# Altium schematic sheet 01.SchDoc
size 840 x 594 mm; Разраб.: Гришель; Обозначение документа: ГУИР.421457.001 Э3; Пров.: Станкевич; Т.контр.: Станкевич; Н.контр.: Лихачёв; Утв.: Петровский; Номер листа: 1; Общее количество листов: 2; Литера: Т; Наименование организации: БГУИР, гр. 250701; Наименование изделия 1: Плата отладочная; Наименование изделия 2: Схема электрическая; Наименование изделия 3: принципиальная; Нач. отд.: Реценз.
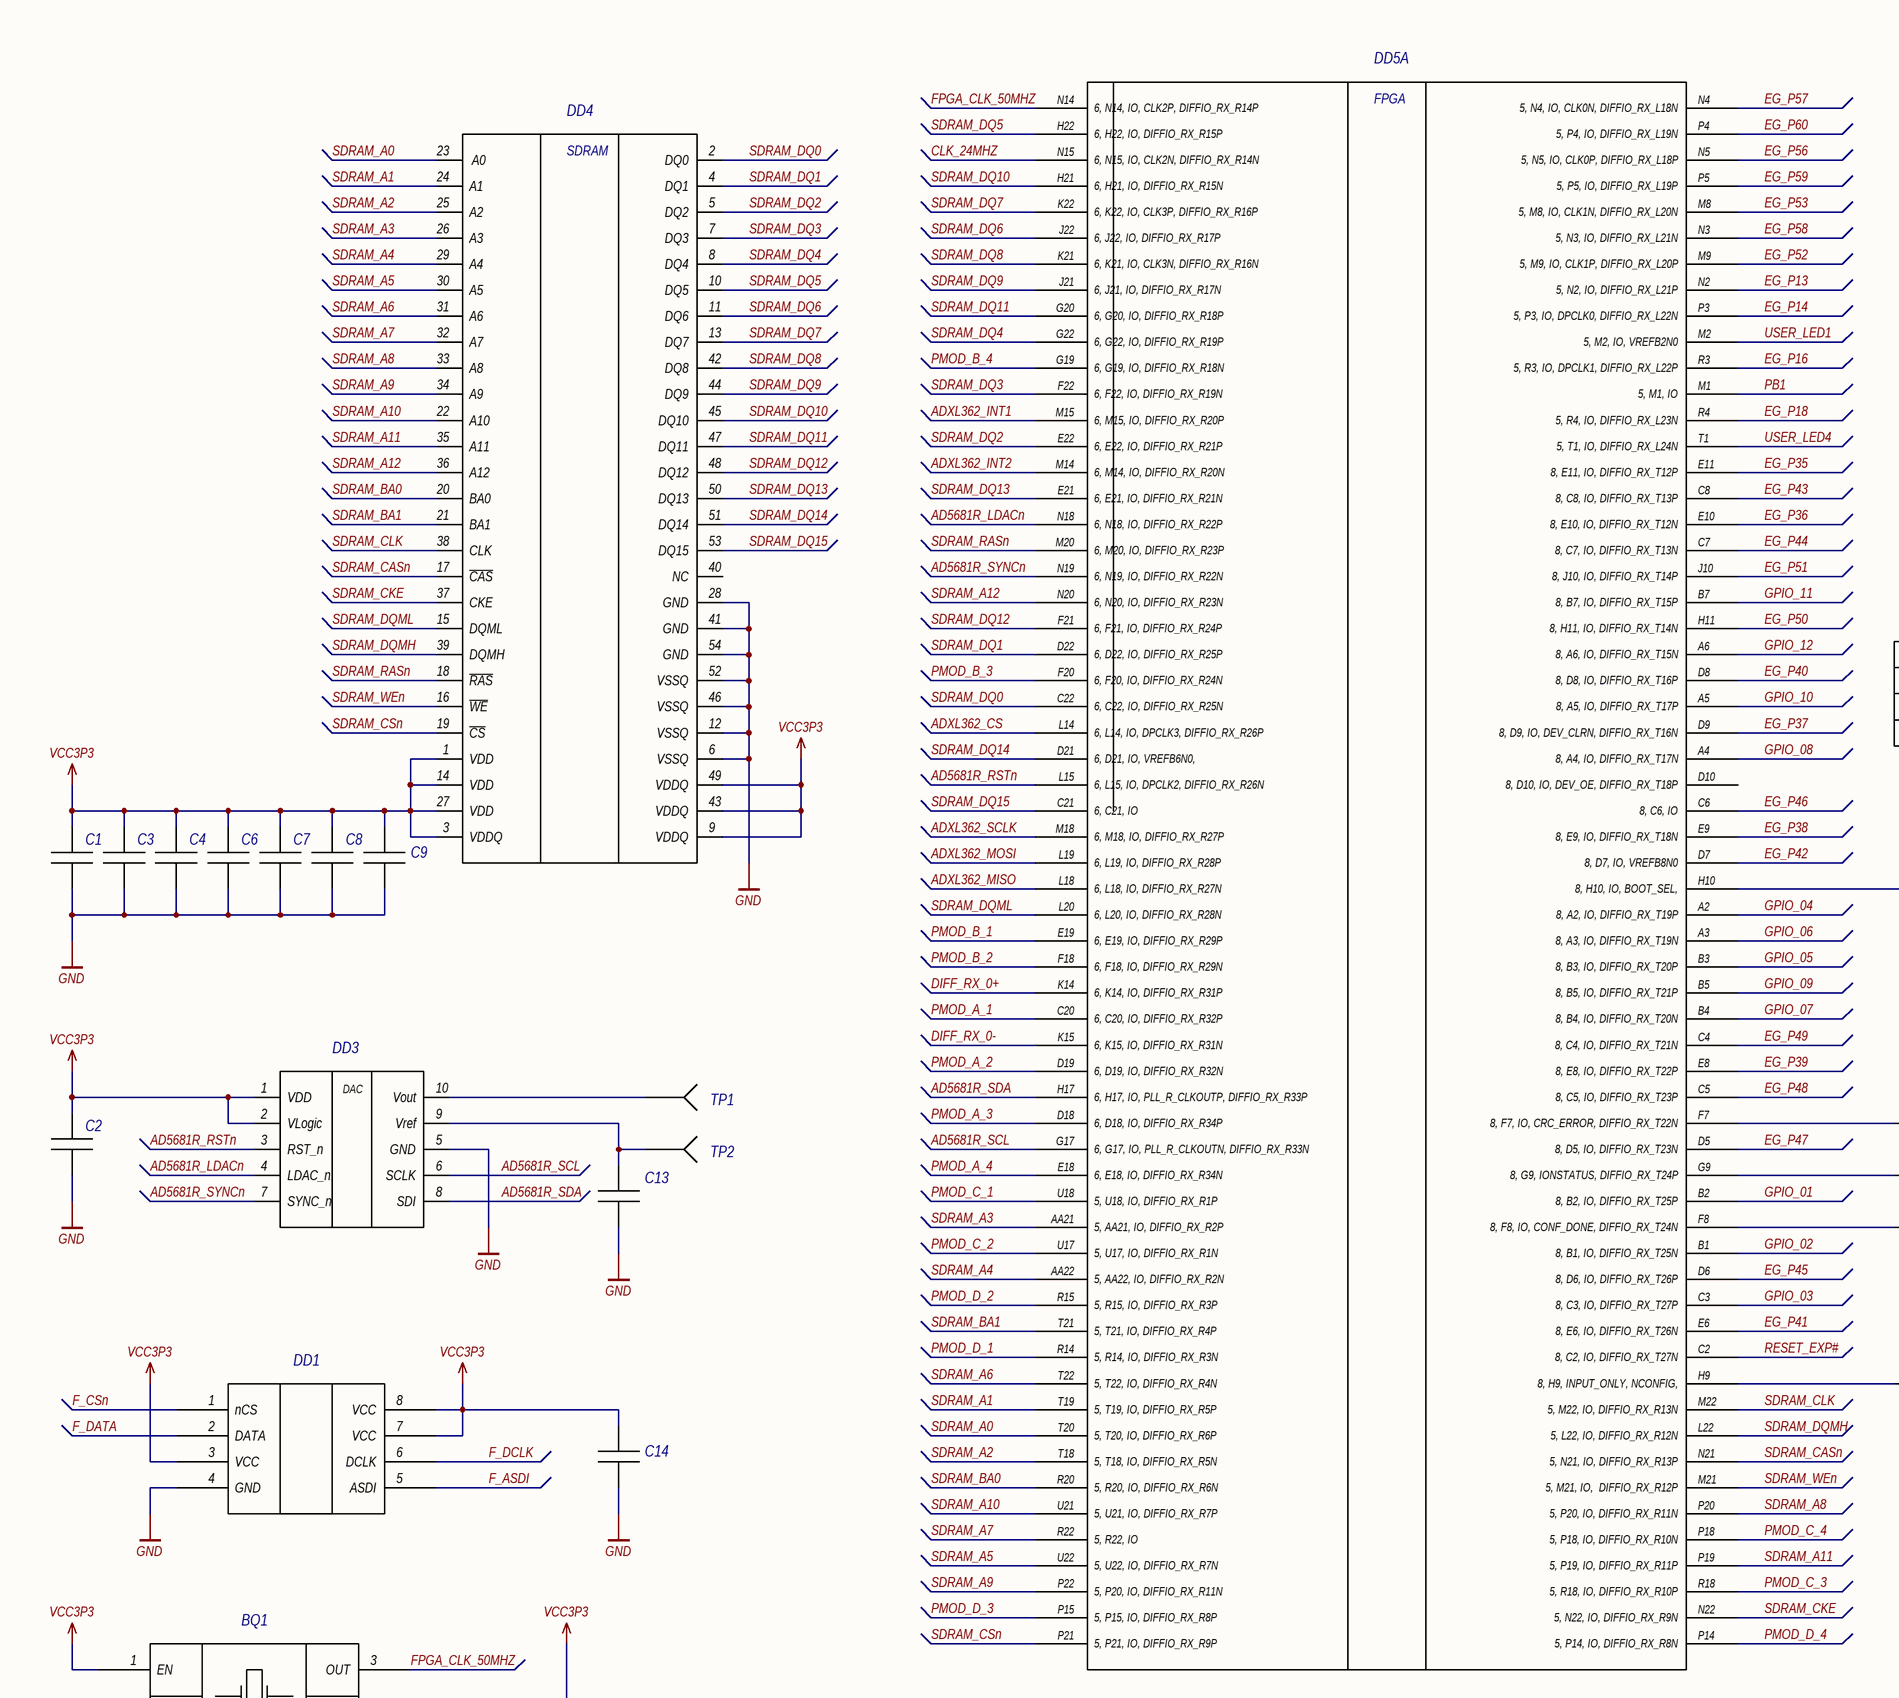
[diagram p0: 01.SchDoc, top left]
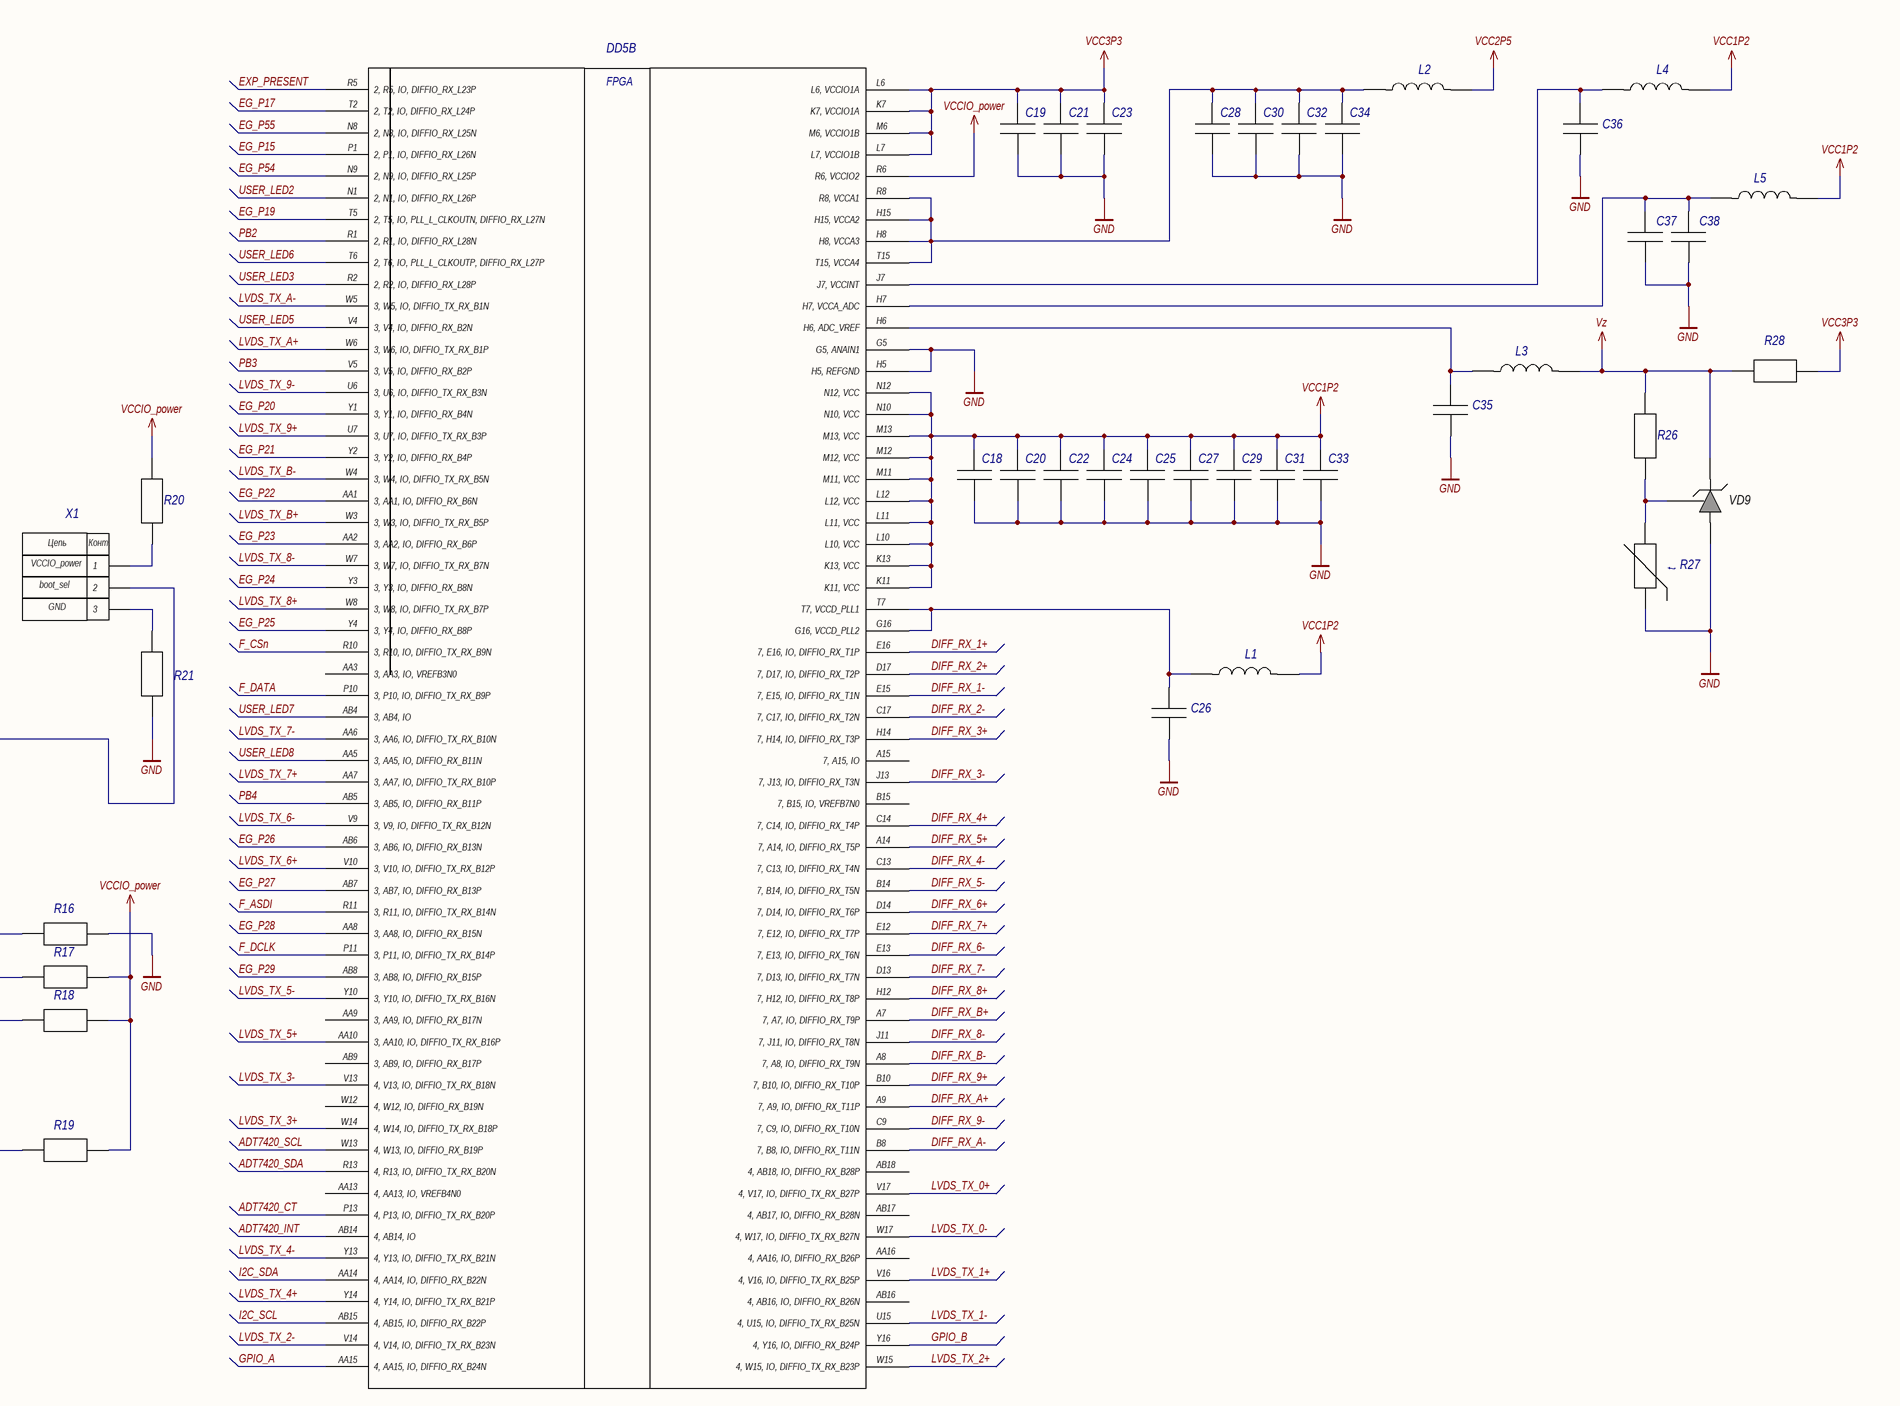
[diagram p1: 01.SchDoc, top right]
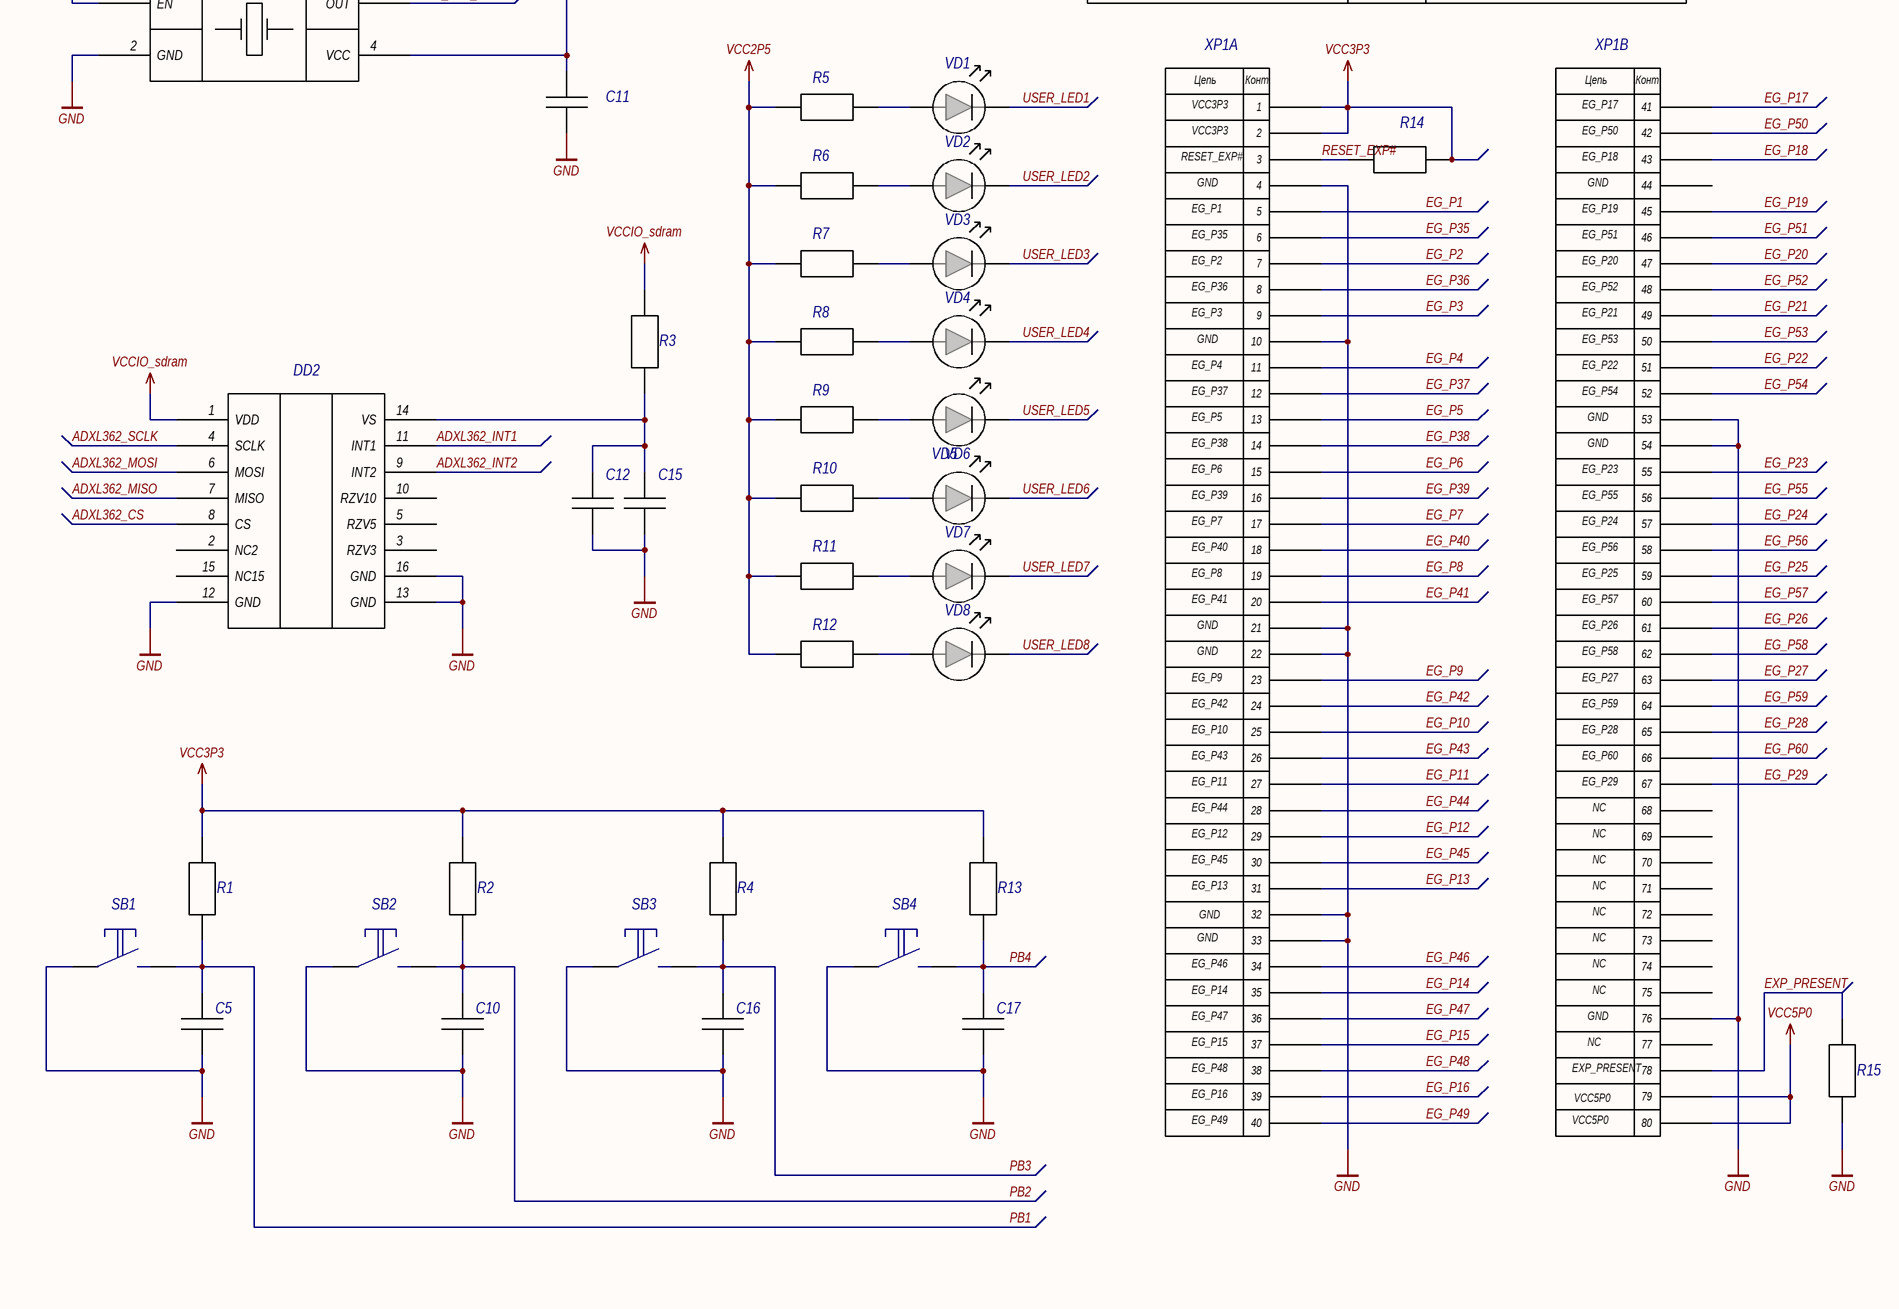
[diagram p2: 01.SchDoc, bottom left]
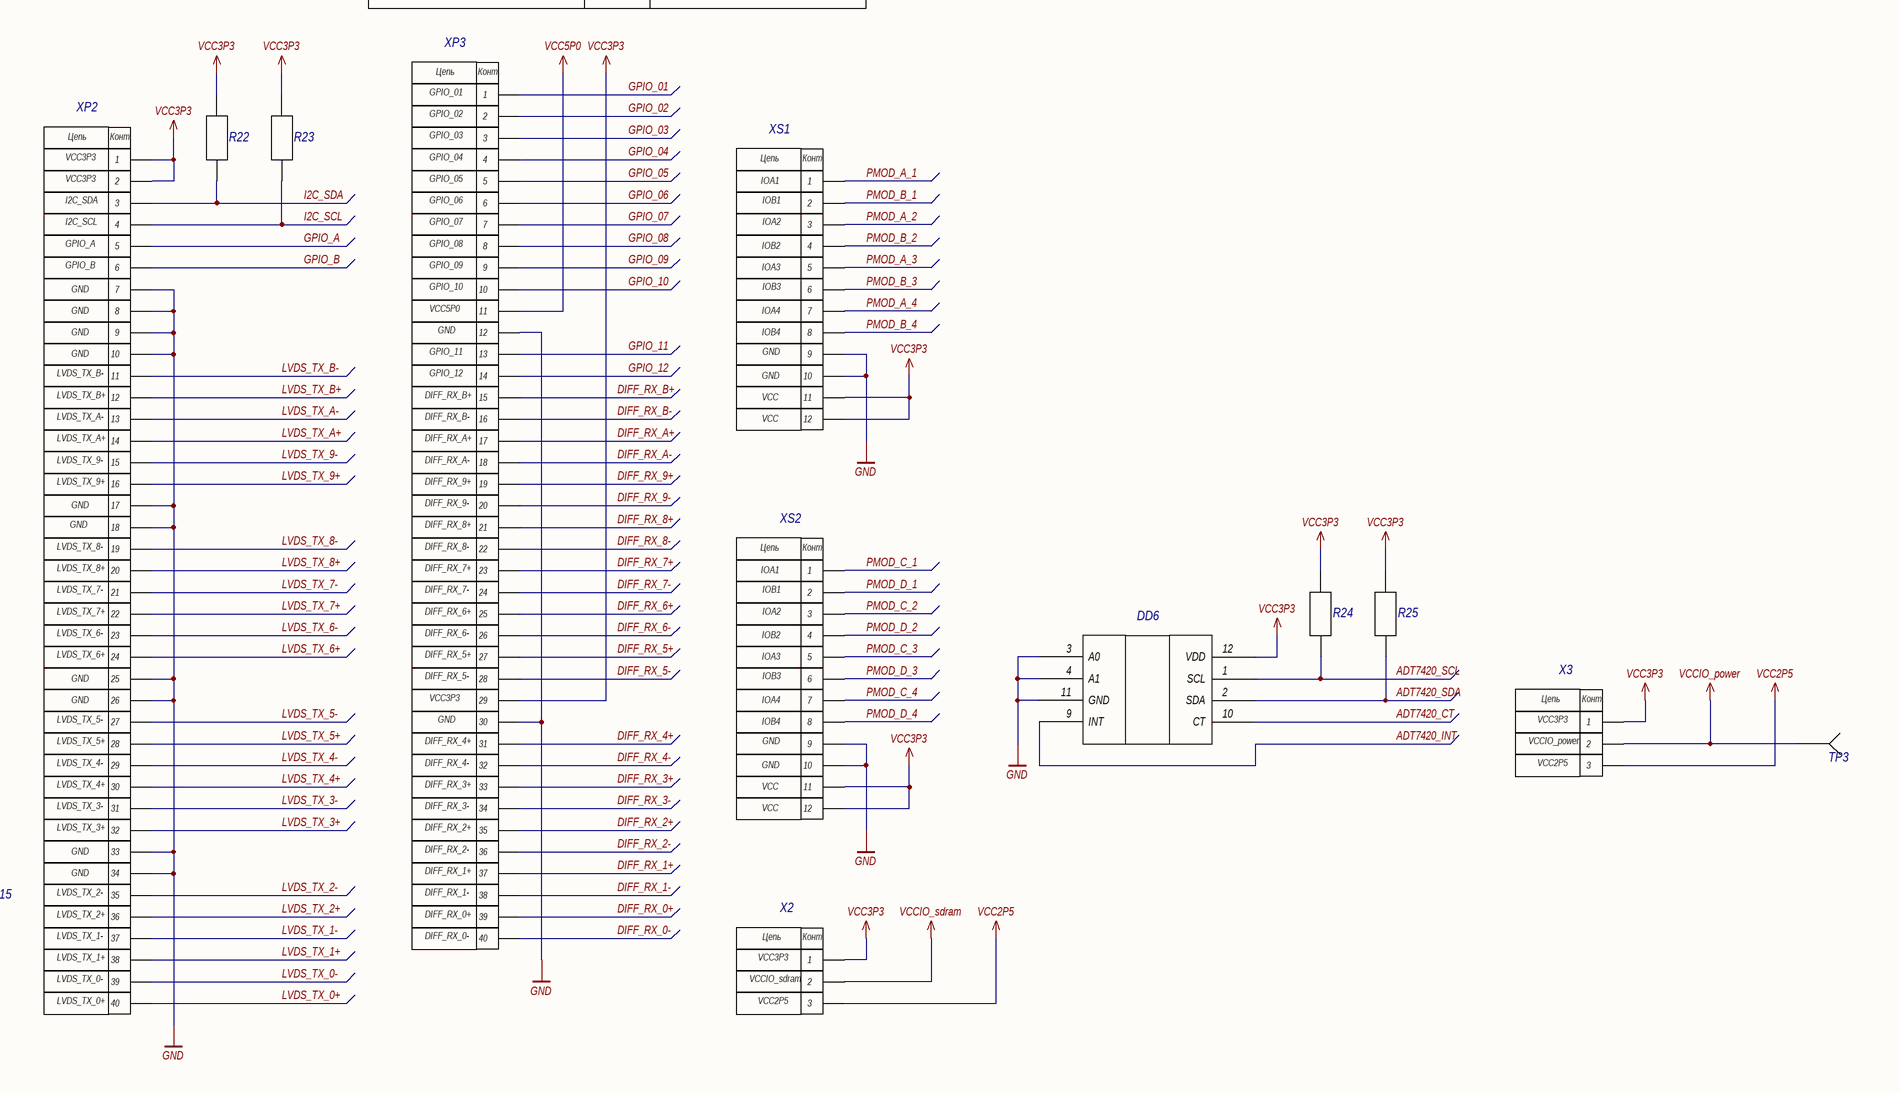
[diagram p3: 01.SchDoc, bottom right]

## Parts
BQ1  Сlock 50 MHz 50ppm  [Crystal_Clock_SMD]  (value not drawn)
C1  1u  [CAPC0603X03L]  (value not drawn)
C2  100n  [Cap_0402]  (value not drawn)
C3  100n  [CAPC0603X03L]  (value not drawn)
C4  1u  [CAPC0603X03L]  (value not drawn)
C5  1u  [Cap_0402]  (value not drawn)
C6  100n  [CAPC0603X03L]  (value not drawn)
C7  1u  [CAPC0603X03L]  (value not drawn)
C8  100n  [CAPC0603X03L]  (value not drawn)
C9  10n  [CAPC0603X03L]  (value not drawn)
C10  1u  [Cap_0402]  (value not drawn)
C11  100n  [Cap_0402]  (value not drawn)
C12  1u  [Cap_0402]  (value not drawn)
C13  10n  [Cap_0402]  (value not drawn)
C14  100n  [Cap_0402]  (value not drawn)
C15  1u  [Cap_0402]  (value not drawn)
C16  1u  [Cap_0402]  (value not drawn)
C17  1u  [Cap_0402]  (value not drawn)
C18  10n  [CAPC0603X03L]  (value not drawn)
C19  100n  [CAPC0603X03L]  (value not drawn)
C20  10n  [CAPC0603X03L]  (value not drawn)
C21  100n  [CAPC0603X03L]  (value not drawn)
C22  10n  [CAPC0603X03L]  (value not drawn)
C23  10u  [Cap_0603]  (value not drawn)
C24  100n  [CAPC0603X03L]  (value not drawn)
C25  100n  [CAPC0603X03L]  (value not drawn)
C26  100n  [CAPC0603X03L]  (value not drawn)
C27  100n  [CAPC0603X03L]  (value not drawn)
C28  100n  [CAPC0603X03L]  (value not drawn)
C29  1u  [CAPC0603X03L]  (value not drawn)
C30  100n  [CAPC0603X03L]  (value not drawn)
C31  1u  [CAPC0603X03L]  (value not drawn)
C32  100n  [CAPC0603X03L]  (value not drawn)
C33  10u  [Cap_0603]  (value not drawn)
C34  100n  [CAPC0603X03L]  (value not drawn)
C35  100n  [CAPC0603X03L]  (value not drawn)
C36  100n  [CAPC0603X03L]  (value not drawn)
C37  100n  [CAPC0603X03L]  (value not drawn)
C38  10u  [Cap_0603]  (value not drawn)
DD1  16Mb serial flash M25P16-VMN6  [M25P16-VMN6 _serial_flash]  (value not drawn)
DD2  Accelerometer 16 pins  [ADXL362_Accelerometer]  (value not drawn)
DD3  12-bit DAC  [AD5681R_12-bit DAC]  (value not drawn)
DD4  SDRAM 8 MB 54 pins  [SDRAM_IS42S16400J-7TL]  (value not drawn)
DD5  MAX 10 FPGFA  [10M08DAF484_V2]  (value not drawn)  (parts A,B of 3)
DD6  Temperature sensor ADT7420  [ADT7420_temperature sensor]  (value not drawn)
L1  4.7u  [Inductor]  (value not drawn)
L2  4.7u  [Inductor]  (value not drawn)
L3  4.7u  [Inductor]  (value not drawn)
L4  4.7u  [Inductor]  (value not drawn)
L5  4.7u  [Inductor]  (value not drawn)
R1  10k  [RESISTOR_0402]  (value not drawn)
R2  10k  [RESISTOR_0402]  (value not drawn)
R3  0  [RESISTOR_0402]  (value not drawn)
R4  10k  [RESISTOR_0402]  (value not drawn)
R5  220  [Resistor_0603]  (value not drawn)
R6  220  [Resistor_0603]  (value not drawn)
R7  220  [Resistor_0603]  (value not drawn)
R8  220  [Resistor_0603]  (value not drawn)
R9  220  [Resistor_0603]  (value not drawn)
R10  220  [Resistor_0603]  (value not drawn)
R11  220  [Resistor_0603]  (value not drawn)
R12  220  [Resistor_0603]  (value not drawn)
R13  10k  [RESISTOR_0402]  (value not drawn)
R14  10k  [RESISTOR_0402]  (value not drawn)
R15  10k  [RESISTOR_0402]  (value not drawn)
R16  10k  [RESISTOR_0402]  (value not drawn)
R17  10k  [RESISTOR_0402]  (value not drawn)
R18  10k  [RESISTOR_0402]  (value not drawn)
R19  10k  [RESISTOR_0402]  (value not drawn)
R20  10k  [RESISTOR_0402]  (value not drawn)
R21  10k  [RESISTOR_0402]  (value not drawn)
R22  4.7k  [RESISTOR_0402]  (value not drawn)
R23  4.7k  [RESISTOR_0402]  (value not drawn)
R24  4.7k  [RESISTOR_0402]  (value not drawn)
R25  4.7k  [RESISTOR_0402]  (value not drawn)
R26  12.1k  [RESISTOR_0402]  (value not drawn)
R27  *  [Thermistor]  (value not drawn)
R28  330  [RESISTOR_0402]  (value not drawn)
SB1  Button  [Button_SMD]  (value not drawn)
SB2  Button  [Button_SMD]  (value not drawn)
SB3  Button  [Button_SMD]  (value not drawn)
SB4  Button  [Button_SMD]  (value not drawn)
TP1  Testpoint  [TP]  (value not drawn)  (no BOM)
TP2  Testpoint  [TP]  (value not drawn)  (no BOM)
TP3  Testpoint  [TP]  (value not drawn)  (no BOM)
VD1  LED_green  [LED_smd]  (value not drawn)
VD2  LED_green  [LED_smd]  (value not drawn)
VD3  LED_green  [LED_smd]  (value not drawn)
VD4  LED_green  [LED_smd]  (value not drawn)
VD5  LED_green  [LED_smd]  (value not drawn)
VD6  LED_green  [LED_smd]  (value not drawn)
VD7  LED_green  [LED_smd]  (value not drawn)
VD8  LED_green  [LED_smd]  (value not drawn)
VD9  0-Diode  [Diode_BAT54C]  (value not drawn)
X1  Jumper_J3  [CONN_J3_PIN_HEADER_1x3_2.54mm _bootselect]  (value not drawn)
X2  Jumper_J9  [CONN_J1,J9_PIN_HEADER_1x3_2.0mm]  (value not drawn)
X3  Jumper_J1  [CONN_J1,J9_PIN_HEADER_1x3_2.0mm]  (value not drawn)
XP1  80-pin edge connector (J2)  [MEC6-140-02-S-DV-A]  (value not drawn)  (parts A,B of 2)
XP2  2x20 pin headers (J4)  [CONN_J4,J5_PIN_HEADER_2x20_2.54mm]  (value not drawn)
XP3  2x20 pin headers (J5)  [CONN_J4,J5_PIN_HEADER_2x20_2.54mm]  (value not drawn)
XS1  Сonnector  PMOD Female Header  [CONN_U5, U6_Female Header 2x6, 2.54mm]  (value not drawn)
XS2  Сonnector  PMOD Female Header  [CONN_U5, U6_Female Header 2x6, 2.54mm]  (value not drawn)

## Nets
GND: BQ1.2(GND) C1.1 C2.1 C3.1 C4.1 C5.2 C6.1 C7.1 C8.1 C9.1 C10.2 C11.1 C12.1 C13.1 C14.1 C15.1 C16.2 C17.2 C18.1 C19.1 C20.1 C21.1 C22.1 C23.1 C24.1 C25.1 C26.1 C27.1 C28.1 C29.1 C30.1 C31.1 C32.1 C33.1 C34.1 C35.1 C36.1 C37.1 C38.1 DD1.4(GND) DD2.12(GND) DD2.13(GND) DD2.16(GND) DD2.17 DD3.5(GND) DD4.6(VSSQ) DD4.12(VSSQ) DD4.28(GND) DD4.41(GND) DD4.46(VSSQ) DD4.52(VSSQ) DD4.54(GND) DD5.G5(G5,_ANAIN1) DD5.H5(H5,_REFGND) DD6.3(A0) DD6.4(A1) DD6.11(GND) DD6.17 R15.1 R16.2 R21.1 R27.1 SB1.1 SB2.1 SB3.1 SB4.1 VD9.3(Anode) XP1.4 XP1.10 XP1.21 XP1.22 XP1.32 XP1.33 XP1.53 XP1.54 XP1.76 XP2.7 XP2.8 XP2.9 XP2.10 XP2.17 XP2.18 XP2.25 XP2.26 XP2.33 XP2.34 XP3.12 XP3.30 XS1.9 XS1.10 XS2.9 XS2.10
VCC1P2: C18.2 C20.2 C22.2 C24.2 C25.2 C27.2 C29.2 C31.2 C33.2 DD5.K11(K11,_VCC) DD5.K13(K13,_VCC) DD5.L10(L10,_VCC) DD5.L11(L11,_VCC) DD5.L12(L12,_VCC) DD5.M11(M11,_VCC) DD5.M12(M12,_VCC) DD5.M13(M13,_VCC) DD5.N10(N10,_VCC) DD5.N12(N12,_VCC) L1.2 L4.2 L5.2
VCC2P5: L2.2 R5.2 R6.2 R7.2 R8.2 R9.2 R10.2 R11.2 R12.2 X2.3 X3.3
VCC3P3: BQ1.1(EN) BQ1.4(VCC) C1.2 C2.2 C3.2 C4.2 C6.2 C7.2 C8.2 C9.2 C11.2 C14.2 C19.2 C21.2 C23.2 DD1.3(VCC) DD1.7(VCC) DD1.8(VCC) DD3.1(VDD) DD3.2(VLogic) DD4.1(VDD) DD4.3(VDDQ) DD4.9(VDDQ) DD4.14(VDD) DD4.27(VDD) DD4.43(VDDQ) DD4.49(VDDQ) DD5.K7(K7,_VCCIO1A) DD5.L6(L6,_VCCIO1A) DD5.L7(L7,_VCCIO1B) DD5.M6(M6,_VCCIO1B) DD6.12(VDD) R1.2 R2.2 R4.2 R13.2 R14.1 R22.2 R23.2 R24.2 R25.2 R28.1 X2.1 X3.1 XP1.1 XP1.2 XP2.1 XP2.2 XP3.29 XS1.11 XS1.12 XS2.11 XS2.12
VCC5P0: XP1.79 XP1.80 XP3.11
VCCIO_power: DD5.R6(R6,_VCCIO2) R17.2 R18.2 R19.2 R20.2 TP3.1(Pad) X3.2
VCCIO_sdram: DD2.1(VDD) R3.2 X2.2
Vz: L3.2 R26.2 R28.2 VD9.2(Cathode)
AD5681R_LDACn: DD3.4(LDAC_n) DD5.N18(6,_N18,_IO,_DIFFIO_RX_R22P)
AD5681R_RSTn: DD3.3(RST_n) DD5.L15(6,_L15,_IO,_DPCLK2,_DIFFIO_RX_R26N)
AD5681R_SCL: DD3.6(SCLK) DD5.G17(6,_G17,_IO,_PLL_R_CLKOUTN,_DIFFIO_RX_R33N)
AD5681R_SDA: DD3.8(SDI) DD5.H17(6,_H17,_IO,_PLL_R_CLKOUTP,_DIFFIO_RX_R33P)
AD5681R_SYNCn: DD3.7(SYNC_n) DD5.N19(6,_N19,_IO,_DIFFIO_RX_R22N)
ADT7420_CT: DD5.P13(4,_P13,_IO,_DIFFIO_TX_RX_B20P) DD6.10(CT)
ADT7420_INT: DD5.AB14(4,_AB14,_IO) DD6.9(INT)
ADT7420_SCL: DD5.W13(4,_W13,_IO,_DIFFIO_RX_B19P) DD6.1(SCL) R24.1
ADT7420_SDA: DD5.R13(4,_R13,_IO,_DIFFIO_TX_RX_B20N) DD6.2(SDA) R25.1
ADXL362_CS: DD2.8(CS) DD5.L14(6,_L14,_IO,_DPCLK3,_DIFFIO_RX_R26P)
ADXL362_INT1: DD2.11(INT1) DD5.M15(6,_M15,_IO,_DIFFIO_RX_R20P)
ADXL362_INT2: DD2.9(INT2) DD5.M14(6,_M14,_IO,_DIFFIO_RX_R20N)
ADXL362_MISO: DD2.7(MISO) DD5.L18(6,_L18,_IO,_DIFFIO_RX_R27N)
ADXL362_MOSI: DD2.6(MOSI) DD5.L19(6,_L19,_IO,_DIFFIO_RX_R28P)
ADXL362_SCLK: DD2.4(SCLK) DD5.M18(6,_M18,_IO,_DIFFIO_RX_R27P)
CLK_24MHZ: DD5.N15(6,_N15,_IO,_CLK2N,_DIFFIO_RX_R14N)
DIFF_RX_0+: DD5.K14(6,_K14,_IO,_DIFFIO_RX_R31P) XP3.39
DIFF_RX_0-: DD5.K15(6,_K15,_IO,_DIFFIO_RX_R31N) XP3.40
DIFF_RX_1+: DD5.E16(7,_E16,_IO,_DIFFIO_RX_T1P) XP3.37
DIFF_RX_1-: DD5.E15(7,_E15,_IO,_DIFFIO_RX_T1N) XP3.38
DIFF_RX_2+: DD5.D17(7,_D17,_IO,_DIFFIO_RX_T2P) XP3.35
DIFF_RX_2-: DD5.C17(7,_C17,_IO,_DIFFIO_RX_T2N) XP3.36
DIFF_RX_3+: DD5.H14(7,_H14,_IO,_DIFFIO_RX_T3P) XP3.33
DIFF_RX_3-: DD5.J13(7,_J13,_IO,_DIFFIO_RX_T3N) XP3.34
DIFF_RX_4+: DD5.C14(7,_C14,_IO,_DIFFIO_RX_T4P) XP3.31
DIFF_RX_4-: DD5.C13(7,_C13,_IO,_DIFFIO_RX_T4N) XP3.32
DIFF_RX_5+: DD5.A14(7,_A14,_IO,_DIFFIO_RX_T5P) XP3.27
DIFF_RX_5-: DD5.B14(7,_B14,_IO,_DIFFIO_RX_T5N) XP3.28
DIFF_RX_6+: DD5.D14(7,_D14,_IO,_DIFFIO_RX_T6P) XP3.25
DIFF_RX_6-: DD5.E13(7,_E13,_IO,_DIFFIO_RX_T6N) XP3.26
DIFF_RX_7+: DD5.E12(7,_E12,_IO,_DIFFIO_RX_T7P) XP3.23
DIFF_RX_7-: DD5.D13(7,_D13,_IO,_DIFFIO_RX_T7N) XP3.24
DIFF_RX_8+: DD5.H12(7,_H12,_IO,_DIFFIO_RX_T8P) XP3.21
DIFF_RX_8-: DD5.J11(7,_J11,_IO,_DIFFIO_RX_T8N) XP3.22
DIFF_RX_9+: DD5.B10(7,_B10,_IO,_DIFFIO_RX_T10P) XP3.19
DIFF_RX_9-: DD5.C9(7,_C9,_IO,_DIFFIO_RX_T10N) XP3.20
DIFF_RX_A+: DD5.A9(7,_A9,_IO,_DIFFIO_RX_T11P) XP3.17
DIFF_RX_A-: DD5.B8(7,_B8,_IO,_DIFFIO_RX_T11N) XP3.18
DIFF_RX_B+: DD5.A7(7,_A7,_IO,_DIFFIO_RX_T9P) XP3.15
DIFF_RX_B-: DD5.A8(7,_A8,_IO,_DIFFIO_RX_T9N) XP3.16
EG_P1: XP1.5
EG_P2: XP1.7
EG_P3: XP1.9
EG_P4: XP1.11
EG_P5: XP1.13
EG_P6: XP1.15
EG_P7: XP1.17
EG_P8: XP1.19
EG_P9: XP1.23
EG_P10: XP1.25
EG_P11: XP1.27
EG_P12: XP1.29
EG_P13: DD5.N2(5,_N2,_IO,_DIFFIO_RX_L21P) XP1.31
EG_P14: DD5.P3(5,_P3,_IO,_DPCLK0,_DIFFIO_RX_L22N) XP1.35
EG_P15: DD5.P1(2,_P1,_IO,_DIFFIO_RX_L26N) XP1.37
EG_P16: DD5.R3(5,_R3,_IO,_DPCLK1,_DIFFIO_RX_L22P) XP1.39
EG_P17: DD5.T2(2,_T2,_IO,_DIFFIO_RX_L24P) XP1.41
EG_P18: DD5.R4(5,_R4,_IO,_DIFFIO_RX_L23N) XP1.43
EG_P19: DD5.T5(2,_T5,_IO,_PLL_L_CLKOUTN,_DIFFIO_RX_L27N) XP1.45
EG_P20: DD5.Y1(3,_Y1,_IO,_DIFFIO_RX_B4N) XP1.47
EG_P21: DD5.Y2(3,_Y2,_IO,_DIFFIO_RX_B4P) XP1.49
EG_P22: DD5.AA1(3,_AA1,_IO,_DIFFIO_RX_B6N) XP1.51
EG_P23: DD5.AA2(3,_AA2,_IO,_DIFFIO_RX_B6P) XP1.55
EG_P24: DD5.Y3(3,_Y3,_IO,_DIFFIO_RX_B8N) XP1.57
EG_P25: DD5.Y4(3,_Y4,_IO,_DIFFIO_RX_B8P) XP1.59
EG_P26: DD5.AB6(3,_AB6,_IO,_DIFFIO_RX_B13N) XP1.61
EG_P27: DD5.AB7(3,_AB7,_IO,_DIFFIO_RX_B13P) XP1.63
EG_P28: DD5.AA8(3,_AA8,_IO,_DIFFIO_RX_B15N) XP1.65
EG_P29: DD5.AB8(3,_AB8,_IO,_DIFFIO_RX_B15P) XP1.67
EG_P35: DD5.E11(8,_E11,_IO,_DIFFIO_RX_T12P) XP1.6
EG_P36: DD5.E10(8,_E10,_IO,_DIFFIO_RX_T12N) XP1.8
EG_P37: DD5.D9(8,_D9,_IO,_DEV_CLRN,_DIFFIO_RX_T16N) XP1.12
EG_P38: DD5.E9(8,_E9,_IO,_DIFFIO_RX_T18N) XP1.14
EG_P39: DD5.E8(8,_E8,_IO,_DIFFIO_RX_T22P) XP1.16
EG_P40: DD5.D8(8,_D8,_IO,_DIFFIO_RX_T16P) XP1.18
EG_P41: DD5.E6(8,_E6,_IO,_DIFFIO_RX_T26N) XP1.20
EG_P42: DD5.D7(8,_D7,_IO,_VREFB8N0) XP1.24
EG_P43: DD5.C8(8,_C8,_IO,_DIFFIO_RX_T13P) XP1.26
EG_P44: DD5.C7(8,_C7,_IO,_DIFFIO_RX_T13N) XP1.28
EG_P45: DD5.D6(8,_D6,_IO,_DIFFIO_RX_T26P) XP1.30
EG_P46: DD5.C6(8,_C6,_IO) XP1.34
EG_P47: DD5.D5(8,_D5,_IO,_DIFFIO_RX_T23N) XP1.36
EG_P48: DD5.C5(8,_C5,_IO,_DIFFIO_RX_T23P) XP1.38
EG_P49: DD5.C4(8,_C4,_IO,_DIFFIO_RX_T21N) XP1.40
EG_P50: DD5.H11(8,_H11,_IO,_DIFFIO_RX_T14N) XP1.42
EG_P51: DD5.J10(8,_J10,_IO,_DIFFIO_RX_T14P) XP1.46
EG_P52: DD5.M9(5,_M9,_IO,_CLK1P,_DIFFIO_RX_L20P) XP1.48
EG_P53: DD5.M8(5,_M8,_IO,_CLK1N,_DIFFIO_RX_L20N) XP1.50
EG_P54: DD5.N9(2,_N9,_IO,_DIFFIO_RX_L25P) XP1.52
EG_P55: DD5.N8(2,_N8,_IO,_DIFFIO_RX_L25N) XP1.56
EG_P56: DD5.N5(5,_N5,_IO,_CLK0P,_DIFFIO_RX_L18P) XP1.58
EG_P57: DD5.N4(5,_N4,_IO,_CLK0N,_DIFFIO_RX_L18N) XP1.60
EG_P58: DD5.N3(5,_N3,_IO,_DIFFIO_RX_L21N) XP1.62
EG_P59: DD5.P5(5,_P5,_IO,_DIFFIO_RX_L19P) XP1.64
EG_P60: DD5.P4(5,_P4,_IO,_DIFFIO_RX_L19N) XP1.66
EXP_PRESENT: DD5.R5(2,_R5,_IO,_DIFFIO_RX_L23P) R15.2 XP1.78
F_ASDI: DD1.5(ASDI) DD5.R11(3,_R11,_IO,_DIFFIO_TX_RX_B14N)
F_CSn: DD1.1(nCS) DD5.R10(3,_R10,_IO,_DIFFIO_TX_RX_B9N)
F_DATA: DD1.2(DATA) DD5.P10(3,_P10,_IO,_DIFFIO_TX_RX_B9P)
F_DCLK: DD1.6(DCLK) DD5.P11(3,_P11,_IO,_DIFFIO_TX_RX_B14P)
FPGA_CLK_50MHZ: BQ1.3(OUT) DD5.N14(6,_N14,_IO,_CLK2P,_DIFFIO_RX_R14P)
GPIO_01: DD5.B2(8,_B2,_IO,_DIFFIO_RX_T25P) XP3.1
GPIO_02: DD5.B1(8,_B1,_IO,_DIFFIO_RX_T25N) XP3.2
GPIO_03: DD5.C3(8,_C3,_IO,_DIFFIO_RX_T27P) XP3.3
GPIO_04: DD5.A2(8,_A2,_IO,_DIFFIO_RX_T19P) XP3.4
GPIO_05: DD5.B3(8,_B3,_IO,_DIFFIO_RX_T20P) XP3.5
GPIO_06: DD5.A3(8,_A3,_IO,_DIFFIO_RX_T19N) XP3.6
GPIO_07: DD5.B4(8,_B4,_IO,_DIFFIO_RX_T20N) XP3.7
GPIO_08: DD5.A4(8,_A4,_IO,_DIFFIO_RX_T17N) XP3.8
GPIO_09: DD5.B5(8,_B5,_IO,_DIFFIO_RX_T21P) XP3.9
GPIO_10: DD5.A5(8,_A5,_IO,_DIFFIO_RX_T17P) XP3.10
GPIO_11: DD5.B7(8,_B7,_IO,_DIFFIO_RX_T15P) XP3.13
GPIO_12: DD5.A6(8,_A6,_IO,_DIFFIO_RX_T15N) XP3.14
GPIO_A: DD5.AA15(4,_AA15,_IO,_DIFFIO_RX_B24N) XP2.5
GPIO_B: DD5.Y16(4,_Y16,_IO,_DIFFIO_RX_B24P) XP2.6
I2C_SCL: DD5.AB15(4,_AB15,_IO,_DIFFIO_RX_B22P) R23.1 XP2.4
I2C_SDA: DD5.AA14(4,_AA14,_IO,_DIFFIO_RX_B22N) R22.1 XP2.3
LVDS_TX_0+: DD5.V17(4,_V17,_IO,_DIFFIO_TX_RX_B27P) XP2.40
LVDS_TX_0-: DD5.W17(4,_W17,_IO,_DIFFIO_TX_RX_B27N) XP2.39
LVDS_TX_1+: DD5.V16(4,_V16,_IO,_DIFFIO_TX_RX_B25P) XP2.38
LVDS_TX_1-: DD5.U15(4,_U15,_IO,_DIFFIO_TX_RX_B25N) XP2.37
LVDS_TX_2+: DD5.W15(4,_W15,_IO,_DIFFIO_TX_RX_B23P) XP2.36
LVDS_TX_2-: DD5.V14(4,_V14,_IO,_DIFFIO_TX_RX_B23N) XP2.35
LVDS_TX_3+: DD5.W14(4,_W14,_IO,_DIFFIO_TX_RX_B18P) XP2.32
LVDS_TX_3-: DD5.V13(4,_V13,_IO,_DIFFIO_TX_RX_B18N) XP2.31
LVDS_TX_4+: DD5.Y14(4,_Y14,_IO,_DIFFIO_TX_RX_B21P) XP2.30
LVDS_TX_4-: DD5.Y13(4,_Y13,_IO,_DIFFIO_TX_RX_B21N) XP2.29
LVDS_TX_5+: DD5.AA10(3,_AA10,_IO,_DIFFIO_TX_RX_B16P) XP2.28
LVDS_TX_5-: DD5.Y10(3,_Y10,_IO,_DIFFIO_TX_RX_B16N) XP2.27
LVDS_TX_6+: DD5.V10(3,_V10,_IO,_DIFFIO_TX_RX_B12P) XP2.24
LVDS_TX_6-: DD5.V9(3,_V9,_IO,_DIFFIO_TX_RX_B12N) XP2.23
LVDS_TX_7+: DD5.AA7(3,_AA7,_IO,_DIFFIO_TX_RX_B10P) XP2.22
LVDS_TX_7-: DD5.AA6(3,_AA6,_IO,_DIFFIO_TX_RX_B10N) XP2.21
LVDS_TX_8+: DD5.W8(3,_W8,_IO,_DIFFIO_TX_RX_B7P) XP2.20
LVDS_TX_8-: DD5.W7(3,_W7,_IO,_DIFFIO_TX_RX_B7N) XP2.19
LVDS_TX_9+: DD5.U7(3,_U7,_IO,_DIFFIO_TX_RX_B3P) XP2.16
LVDS_TX_9-: DD5.U6(3,_U6,_IO,_DIFFIO_TX_RX_B3N) XP2.15
LVDS_TX_A+: DD5.W6(3,_W6,_IO,_DIFFIO_TX_RX_B1P) XP2.14
LVDS_TX_A-: DD5.W5(3,_W5,_IO,_DIFFIO_TX_RX_B1N) XP2.13
LVDS_TX_B+: DD5.W3(3,_W3,_IO,_DIFFIO_TX_RX_B5P) XP2.12
LVDS_TX_B-: DD5.W4(3,_W4,_IO,_DIFFIO_TX_RX_B5N) XP2.11
PB1: C5.1 DD5.M1(5,_M1,_IO) R1.1 SB1.2
PB2: C10.1 DD5.R1(2,_R1,_IO,_DIFFIO_RX_L28N) R2.1 SB2.2
PB3: C16.1 DD5.V5(3,_V5,_IO,_DIFFIO_RX_B2P) R4.1 SB3.2
PB4: C17.1 DD5.AB5(3,_AB5,_IO,_DIFFIO_RX_B11P) R13.1 SB4.2
PMOD_A_1: DD5.C20(6,_C20,_IO,_DIFFIO_RX_R32P) XS1.1
PMOD_A_2: DD5.D19(6,_D19,_IO,_DIFFIO_RX_R32N) XS1.3
PMOD_A_3: DD5.D18(6,_D18,_IO,_DIFFIO_RX_R34P) XS1.5
PMOD_A_4: DD5.E18(6,_E18,_IO,_DIFFIO_RX_R34N) XS1.7
PMOD_B_1: DD5.E19(6,_E19,_IO,_DIFFIO_RX_R29P) XS1.2
PMOD_B_2: DD5.F18(6,_F18,_IO,_DIFFIO_RX_R29N) XS1.4
PMOD_B_3: DD5.F20(6,_F20,_IO,_DIFFIO_RX_R24N) XS1.6
PMOD_B_4: DD5.G19(6,_G19,_IO,_DIFFIO_RX_R18N) XS1.8
PMOD_C_1: DD5.U18(5,_U18,_IO,_DIFFIO_RX_R1P) XS2.1
PMOD_C_2: DD5.U17(5,_U17,_IO,_DIFFIO_RX_R1N) XS2.3
PMOD_C_3: DD5.R18(5,_R18,_IO,_DIFFIO_RX_R10P) XS2.5
PMOD_C_4: DD5.P18(5,_P18,_IO,_DIFFIO_RX_R10N) XS2.7
PMOD_D_1: DD5.R14(5,_R14,_IO,_DIFFIO_RX_R3N) XS2.2
PMOD_D_2: DD5.R15(5,_R15,_IO,_DIFFIO_RX_R3P) XS2.4
PMOD_D_3: DD5.P15(5,_P15,_IO,_DIFFIO_RX_R8P) XS2.6
PMOD_D_4: DD5.P14(5,_P14,_IO,_DIFFIO_RX_R8N) XS2.8
RESET_EXP#: DD5.C2(8,_C2,_IO,_DIFFIO_RX_T27N) R14.2 XP1.3
SDRAM_A0: DD4.23(A0) DD5.T20(5,_T20,_IO,_DIFFIO_RX_R6P)
SDRAM_A1: DD4.24(A1) DD5.T19(5,_T19,_IO,_DIFFIO_RX_R5P)
SDRAM_A2: DD4.25(A2) DD5.T18(5,_T18,_IO,_DIFFIO_RX_R5N)
SDRAM_A3: DD4.26(A3) DD5.AA21(5,_AA21,_IO,_DIFFIO_RX_R2P)
SDRAM_A4: DD4.29(A4) DD5.AA22(5,_AA22,_IO,_DIFFIO_RX_R2N)
SDRAM_A5: DD4.30(A5) DD5.U22(5,_U22,_IO,_DIFFIO_RX_R7N)
SDRAM_A6: DD4.31(A6) DD5.T22(5,_T22,_IO,_DIFFIO_RX_R4N)
SDRAM_A7: DD4.32(A7) DD5.R22(5,_R22,_IO)
SDRAM_A8: DD4.33(A8) DD5.P20(5,_P20,_IO,_DIFFIO_RX_R11N)
SDRAM_A9: DD4.34(A9) DD5.P22(5,_P20,_IO,_DIFFIO_RX_R11N)
SDRAM_A10: DD4.22(A10) DD5.U21(5,_U21,_IO,_DIFFIO_RX_R7P)
SDRAM_A11: DD4.35(A11) DD5.P19(5,_P19,_IO,_DIFFIO_RX_R11P)
SDRAM_A12: DD4.36(A12) DD5.N20(6,_N20,_IO,_DIFFIO_RX_R23N)
SDRAM_BA0: DD4.20(BA0) DD5.R20(5,_R20,_IO,_DIFFIO_RX_R6N)
SDRAM_BA1: DD4.21(BA1) DD5.T21(5,_T21,_IO,_DIFFIO_RX_R4P)
SDRAM_CASn: DD4.17(~{CAS}) DD5.N21(5,_N21,_IO,_DIFFIO_RX_R13P)
SDRAM_CKE: DD4.37(CKE) DD5.N22(5,_N22,_IO,_DIFFIO_RX_R9N)
SDRAM_CLK: DD4.38(CLK) DD5.M22(5,_M22,_IO,_DIFFIO_RX_R13N)
SDRAM_CSn: DD4.19(~{CS}) DD5.P21(5,_P21,_IO,_DIFFIO_RX_R9P)
SDRAM_DQ0: DD4.2(DQ0) DD5.C22(6,_C22,_IO,_DIFFIO_RX_R25N)
SDRAM_DQ1: DD4.4(DQ1) DD5.D22(6,_D22,_IO,_DIFFIO_RX_R25P)
SDRAM_DQ2: DD4.5(DQ2) DD5.E22(6,_E22,_IO,_DIFFIO_RX_R21P)
SDRAM_DQ3: DD4.7(DQ3) DD5.F22(6,_F22,_IO,_DIFFIO_RX_R19N)
SDRAM_DQ4: DD4.8(DQ4) DD5.G22(6,_G22,_IO,_DIFFIO_RX_R19P)
SDRAM_DQ5: DD4.10(DQ5) DD5.H22(6,_H22,_IO,_DIFFIO_RX_R15P)
SDRAM_DQ6: DD4.11(DQ6) DD5.J22(6,_J22,_IO,_DIFFIO_RX_R17P)
SDRAM_DQ7: DD4.13(DQ7) DD5.K22(6,_K22,_IO,_CLK3P,_DIFFIO_RX_R16P)
SDRAM_DQ8: DD4.42(DQ8) DD5.K21(6,_K21,_IO,_CLK3N,_DIFFIO_RX_R16N)
SDRAM_DQ9: DD4.44(DQ9) DD5.J21(6,_J21,_IO,_DIFFIO_RX_R17N)
SDRAM_DQ10: DD4.45(DQ10) DD5.H21(6,_H21,_IO,_DIFFIO_RX_R15N)
SDRAM_DQ11: DD4.47(DQ11) DD5.G20(6,_G20,_IO,_DIFFIO_RX_R18P)
SDRAM_DQ12: DD4.48(DQ12) DD5.F21(6,_F21,_IO,_DIFFIO_RX_R24P)
SDRAM_DQ13: DD4.50(DQ13) DD5.E21(6,_E21,_IO,_DIFFIO_RX_R21N)
SDRAM_DQ14: DD4.51(DQ14) DD5.D21(6,_D21,_IO,_VREFB6N0,)
SDRAM_DQ15: DD4.53(DQ15) DD5.C21(6,_C21,_IO)
SDRAM_DQMH: DD4.39(DQMH) DD5.L22(5,_L22,_IO,_DIFFIO_RX_R12N)
SDRAM_DQML: DD4.15(DQML) DD5.L20(6,_L20,_IO,_DIFFIO_RX_R28N)
SDRAM_RASn: DD4.18(~{RAS}) DD5.M20(6,_M20,_IO,_DIFFIO_RX_R23P)
SDRAM_WEn: DD4.16(~{WE}) DD5.M21(5,_M21,_IO,__DIFFIO_RX_R12P)
USER_LED1: DD5.M2(5,_M2,_IO,_VREFB2N0) VD1.2
USER_LED2: DD5.N1(2,_N1,_IO,_DIFFIO_RX_L26P) VD2.2
USER_LED3: DD5.R2(2,_R2,_IO,_DIFFIO_RX_L28P) VD3.2
USER_LED4: DD5.T1(5,_T1,_IO,_DIFFIO_RX_L24N) VD4.2
USER_LED5: DD5.V4(3,_V4,_IO,_DIFFIO_RX_B2N) VD5.2
USER_LED6: DD5.T6(2,_T6,_IO,_PLL_L_CLKOUTP,_DIFFIO_RX_L27P) VD6.2
USER_LED7: DD5.AB4(3,_AB4,_IO) VD7.2
USER_LED8: DD5.AA5(3,_AA5,_IO,_DIFFIO_RX_B11N) VD8.2
NetC12_2: C12.2 C15.2 DD2.14(VS) R3.1
NetC13_2: C13.2 DD3.9(Vref) TP2.1(Pad)
NetC26_2: C26.2 DD5.G16(G16,_VCCD_PLL2) DD5.T7(T7,_VCCD_PLL1) L1.1
NetC28_2: C28.2 C30.2 C32.2 C34.2 DD5.H8(H8,_VCCA3) DD5.H15(H15,_VCCA2) DD5.R8(R8,_VCCA1) DD5.T15(T15,_VCCA4) L2.1
NetC35_2: C35.2 DD5.H6(H6,_ADC_VREF) L3.1
NetC36_2: C36.2 DD5.J7(J7,_VCCINT) L4.1
NetC37_2: C37.2 C38.2 DD5.H7(H7,_VCCA_ADC) L5.1
NetDD3_10: DD3.10(Vout) TP1.1(Pad)
NetDD5_F7: DD5.F7(8,_F7,_IO,_CRC_ERROR,_DIFFIO_RX_T22N) R16.1
NetDD5_F8: DD5.F8(8,_F8,_IO,_CONF_DONE,_DIFFIO_RX_T24N) R18.1
NetDD5_G9: DD5.G9(8,_G9,_IONSTATUS,_DIFFIO_RX_T24P) R17.1
NetDD5_H9: DD5.H9(8,_H9,_INPUT_ONLY,_NCONFIG,) R19.1
NetDD5_H10: DD5.H10(8,_H10,_IO,_BOOT_SEL,) X1.2
NetR5_1: R5.1 VD1.1
NetR6_1: R6.1 VD2.1
NetR7_1: R7.1 VD3.1
NetR8_1: R8.1 VD4.1
NetR9_1: R9.1 VD5.1
NetR10_1: R10.1 VD6.1
NetR11_1: R11.1 VD7.1
NetR12_1: R12.1 VD8.1
NetR20_1: R20.1 X1.1
NetR21_2: R21.2 X1.3
NetR26_1: R26.1 R27.2 VD9.1(Ref)

Not connected (* = marked no-connect by the designer): DD2 2(NC2) 3(RZV3) 5(RZV5) 10(RZV10) 15(NC15); DD4 40(NC); DD5 A15(7,_A15,_IO) AA3(3,_AA3,_IO,_VREFB3N0) AA9(3,_AA9,_IO,_DIFFIO_RX_B17N) AA13(4,_AA13,_IO,_VREFB4N0) AA16(4,_AA16,_IO,_DIFFIO_RX_B26P) AB9(3,_AB9,_IO,_DIFFIO_RX_B17P) AB16(4,_AB16,_IO,_DIFFIO_RX_B26N) AB17(4,_AB17,_IO,_DIFFIO_RX_B28N) AB18(4,_AB18,_IO,_DIFFIO_RX_B28P) B15(7,_B15,_IO,_VREFB7N0) D10(8,_D10,_IO,_DEV_OE,_DIFFIO_RX_T18P) W12(4,_W12,_IO,_DIFFIO_RX_B19N); XP1 44 68 69 70 71 72 73 74 75 77

## Notes on the sheet
- Перв. примен.
- Справ. №
- Подп. и дата
- Инв. № дубл.
- Взам. инв. №
- Разраб.
- Изм.
- Лист
- № докум.
- Подп.
- Дата
- Лит.
- Масса
- Масштаб
- Пров.
- Т.контр.
- Листов
- Инв. № подл.
- Утв.
- Н.контр.
- Копировал
- Формат А1
- (in symbol 2x20 pin headers (J4)) Цепь; Конт.; VCC3P3; I2C_SDA; I2C_SCL; GPIO_A; GPIO_B; GND; LVDS_TX_B-; LVDS_TX_B+; LVDS_TX_A-; LVDS_TX_A+; LVDS_TX_9-; LVDS_TX_9+; LVDS_TX_8-; LVDS_TX_8+; LVDS_TX_7-; LVDS_TX_7+; LVDS_TX_6-; LVDS_TX_6+; LVDS_TX_5-; LVDS_TX_5+; LVDS_TX_4-; LVDS_TX_4+; LVDS_TX_3-; LVDS_TX_3+; LVDS_TX_2-; LVDS_TX_2+; LVDS_TX_1-; LVDS_TX_1+; LVDS_TX_0-; LVDS_TX_0+
- (in symbol 2x20 pin headers (J5)) Цепь; Конт.; GPIO_01; GPIO_02; GPIO_03; GPIO_04; GPIO_05; GPIO_06; GPIO_07; GPIO_08; GPIO_09; GPIO_10; VCC5P0; GND; GPIO_11; GPIO_12; DIFF_RX_B+; DIFF_RX_B-; DIFF_RX_A+; DIFF_RX_A-; DIFF_RX_9+; DIFF_RX_9-; DIFF_RX_8+; DIFF_RX_8-; DIFF_RX_7+; DIFF_RX_7-; DIFF_RX_6+; DIFF_RX_6-; DIFF_RX_5+; DIFF_RX_5-; VCC3P3; DIFF_RX_4+; DIFF_RX_4-; DIFF_RX_3+; DIFF_RX_3-; DIFF_RX_2+; DIFF_RX_2-; DIFF_RX_1+; DIFF_RX_1-; DIFF_RX_0+; DIFF_RX_0-
- (in symbol 12-bit DAC) DAC
- (in symbol 80-pin edge connector (J2), part A) Цепь; Конт.; VCC3P3; RESET_EXP#; GND; EG_P1; EG_P35; EG_P2; EG_P36; EG_P3; EG_P4; EG_P37; EG_P5; EG_P38; EG_P6; EG_P39; EG_P7; EG_P40; EG_P8; EG_P41; EG_P9; EG_P42; EG_P10; EG_P43; EG_P11; EG_P44; EG_P12; EG_P45; EG_P13; EG_P46; EG_P14; EG_P47; EG_P15; EG_P48; EG_P16; EG_P49
- (in symbol 80-pin edge connector (J2), part B) Цепь; Конт.; EG_P17; EG_P50; EG_P18; GND; EG_P19; EG_P51; EG_P20; EG_P52; EG_P21; EG_P53; EG_P22; EG_P54; EG_P23; EG_P55; EG_P24; EG_P56; EG_P25; EG_P57; EG_P26; EG_P58; EG_P27; EG_P59; EG_P28; EG_P60; EG_P29; NC; EXP_PRESENT; VCC5P0
- (in symbol Jumper_J1) Цепь; Конт.; VCC3P3; VCCIO_power; VCC2P5
- (in symbol Jumper_J3) Цепь; Конт.; VCCIO_power; boot_sel; GND
- (in symbol Jumper_J9) Цепь; Конт.; VCC3P3; VCCIO_sdram; VCC2P5
- (in symbol MAX 10 FPGFA, part A) FPGA
- (in symbol MAX 10 FPGFA, part B) FPGA
- (in symbol Res_Thermistor) t
- (in symbol SDRAM 8 MB 54 pins) SDRAM
- (in symbol Сonnector  PMOD Female Header) Цепь; Конт.; IOA1; IOB1; IOA2; IOB2; IOA3; IOB3; IOA4; IOB4; GND; VCC

## Library data of the parts
BQ1 = Сlock 50 MHz 50ppm: Clock 50 MHZ  main clock for FPGA  3.2x2.5 mm 3.3V 6.5mA; Manufacturer: Silicon Labs; Name: 501HAA50M0000CAFR
C1 C3 C4 C6-C9 C18-C22 C24-C32 C34-C37 = Cap_0201: Non-polar Capacitor
  C1 C4 C7 C29 C31: Value: 1u
  C3 C6 C8 C19 C21 C24-C28 C30 C32 C34-C37: Value: 100n
  C9 C18 C20 C22: Value: 10n
C2 C5 C10-C17 = Cap_0402: Non-polar Capacitor
  C2 C11 C14: Value: 100n
  C5 C10 C12 C15-C17: Value: 1u
  C13: Value: 10n
C23 C33 C38 = Cap_0603: Non-polar Capacitor; Value: 10u
DD1 = 16Mb serial flash M25P16-VMN6: 16Mb serial flash off-chip processor code storage, etc; Manufacturer: Micron; Name: M25P16-VMN6
DD2 = Accelerometer 16 pins: Accelerometer ADXL362  2.5 or 3.3V 3uA; Manufacturer: ADI; Name: ADXL362BCCZ-RL7 SMD 16 pins
DD3 = 12-bit DAC: 12-bit DAC AD5681R; Manufacturer: ADI; Name: AD5681RBRMZ-RL7
DD4 = SDRAM 8 MB 54 pins: SDRAM 8 MB 3.3V 90mA; Manufacturer: ISSI; Name: IS42S16400J-7TL  TSOPII 4 pins
DD5 = MAX 10 FPGFA: MAX10 10M08DAF484; Manufacturer: ALTERA; Name: 10M08DAF484C8GES
DD6 = Temperature sensor ADT7420: ADT7420 16-lead LFCSP_WQ; Manufacturer: ADI; Name: ADT7420UCPZ-RL7
L1-L5 = Inductor: Inductor  4.7uH/600mA; Manufacturer: Murata; Name: LQM18PN4R7MFR; Value: 4.7u
R1-R4 R13-R26 R28 = Res_0402: Resistor
  R1 R2 R4 R13-R21: Value: 10k
  R3: Value: 0
  R22-R25: Value: 4.7k
  R26: Value: 12.1k
  R28: Value: 330
R5-R12 = Res_0603: Resistor; Value: 220
R27 = Res_Thermistor: Resistor; Value: *
SB1-SB4 = Button: SPST Micro SMD PushButton; Name: Micro SMD PushButton 3.7x6.1x2.5mm 2P; Manufacturer: *
TP1-TP3 = Testpoint: Standard Testing Point
VD1-VD8 = LED_green: LED GREEN CLEAR 2.3V 30mA 8-bit output, two for status; Manufacturer: Bet Lux Electronics; Name: BL-LS0603GC SMD
VD9 = Diode Adjustable Shunt Regulator (U14): SPX432 1.24V SOT-23; Manufacturer: Diodes Incorporated; Name: SPX432 1.24V SOT-23
X1 = Jumper_J3: Jumper 2.54mm pitch (default short PIN 1 and 2) 1x3_2.54mm boot select
X2 = Jumper_J9: Jumper 2.00mm pitch (default short PIN 1 and 2) 3.3V or 2.5V VCCIO selection 1x3_2.0mm
X3 = Jumper_J1: Jumper 2.00mm pitch (default short PIN 1 and 2) 3.3V or 2.5V VCCIO selection  1x3_2.0mm
XP1 = 80-pin edge connector (J2): MEC6-140_CARD; Name: MEC6-140_CARD
XP2 = 2x20 pin headers (J4): PIN_HEADER_2x20_2.54mm 2x 20 pin headers for expansion and loopback
XP3 = 2x20 pin headers (J5): PIN_HEADER_2x20_2.54mm 2x 20 pin headers for expansion and loopback
XS1 XS2 = Сonnector  PMOD Female Header: PMOD Female 2x6, 2.54 mm, DIP; Manufacturer: TE Connectivity AMP Connectors; Name: PMOD Connectors